# Altium schematic sheet CONN.SchDoc: =ProjectName
size A4; CheckedBy: DatNB; Author: Ven; CompanyName: Nacentech; Organization: IMET
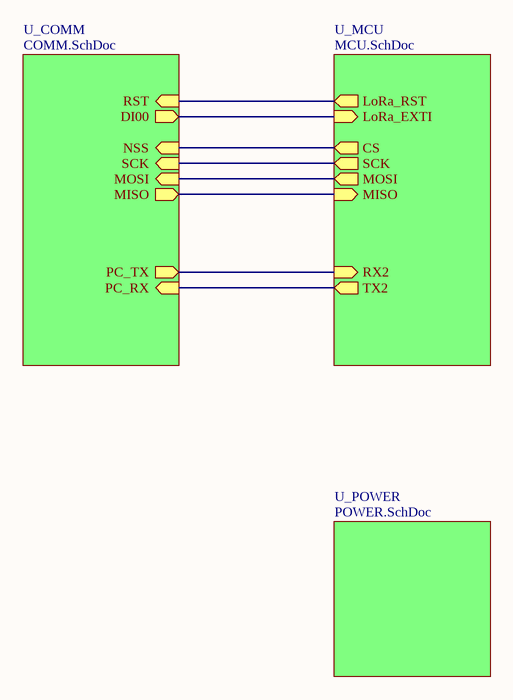
[diagram p0: CONN.SchDoc]

## Sub-sheets
U_COMM = COMM.SchDoc: PC_TX (out), PC_RX (in), MOSI (in), MISO (out), NSS (in), RST (in), SCK (in), DI00 (out)
U_MCU = MCU.SchDoc: RX2 (in), TX2 (out), MOSI (out), MISO (in), SCK (out), LoRa_RST (out), CS (out), LoRa_EXTI (in)
U_POWER = POWER.SchDoc: no entries

## Nets
(unnamed): sheet U_COMM/PC_TX, sheet U_MCU/RX2
(unnamed): sheet U_COMM/PC_RX, sheet U_MCU/TX2
(unnamed): sheet U_COMM/MOSI, sheet U_MCU/MOSI
(unnamed): sheet U_COMM/MISO, sheet U_MCU/MISO
(unnamed): sheet U_COMM/NSS, sheet U_MCU/CS
(unnamed): sheet U_COMM/RST, sheet U_MCU/LoRa_RST
(unnamed): sheet U_COMM/SCK, sheet U_MCU/SCK
(unnamed): sheet U_COMM/DI00, sheet U_MCU/LoRa_EXTI

## Notes on the sheet
- Project:
- Page Contents:
- Size:
- Date:
- A4
- Checked by:
- Time:
- Revision:
- Sheet
- of
- File: